# Altium schematic sheet Level Translators.SchDoc
size A2
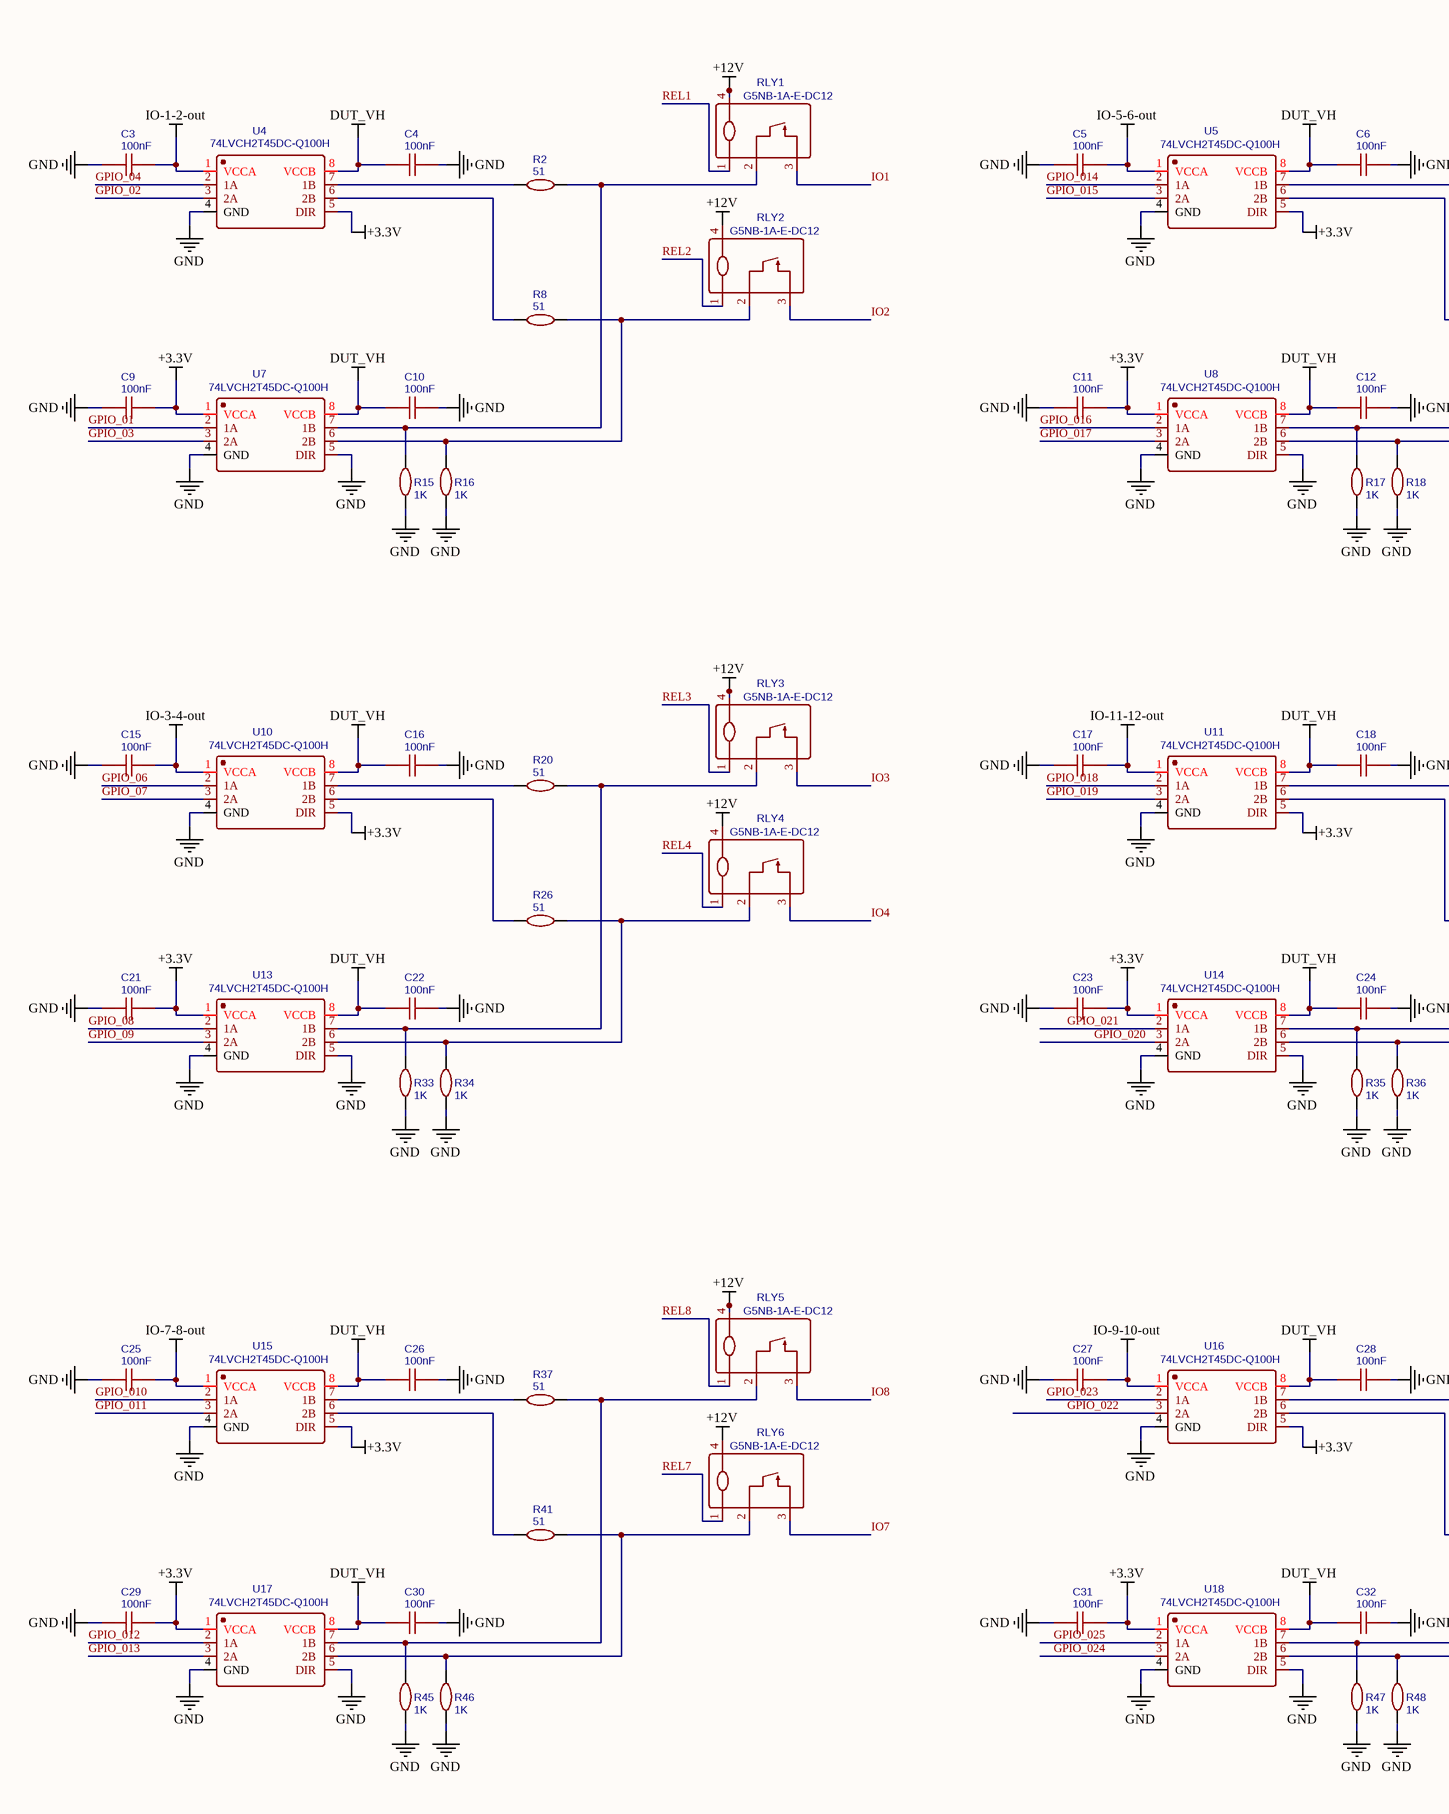
[diagram p0: Level Translators.SchDoc, left]
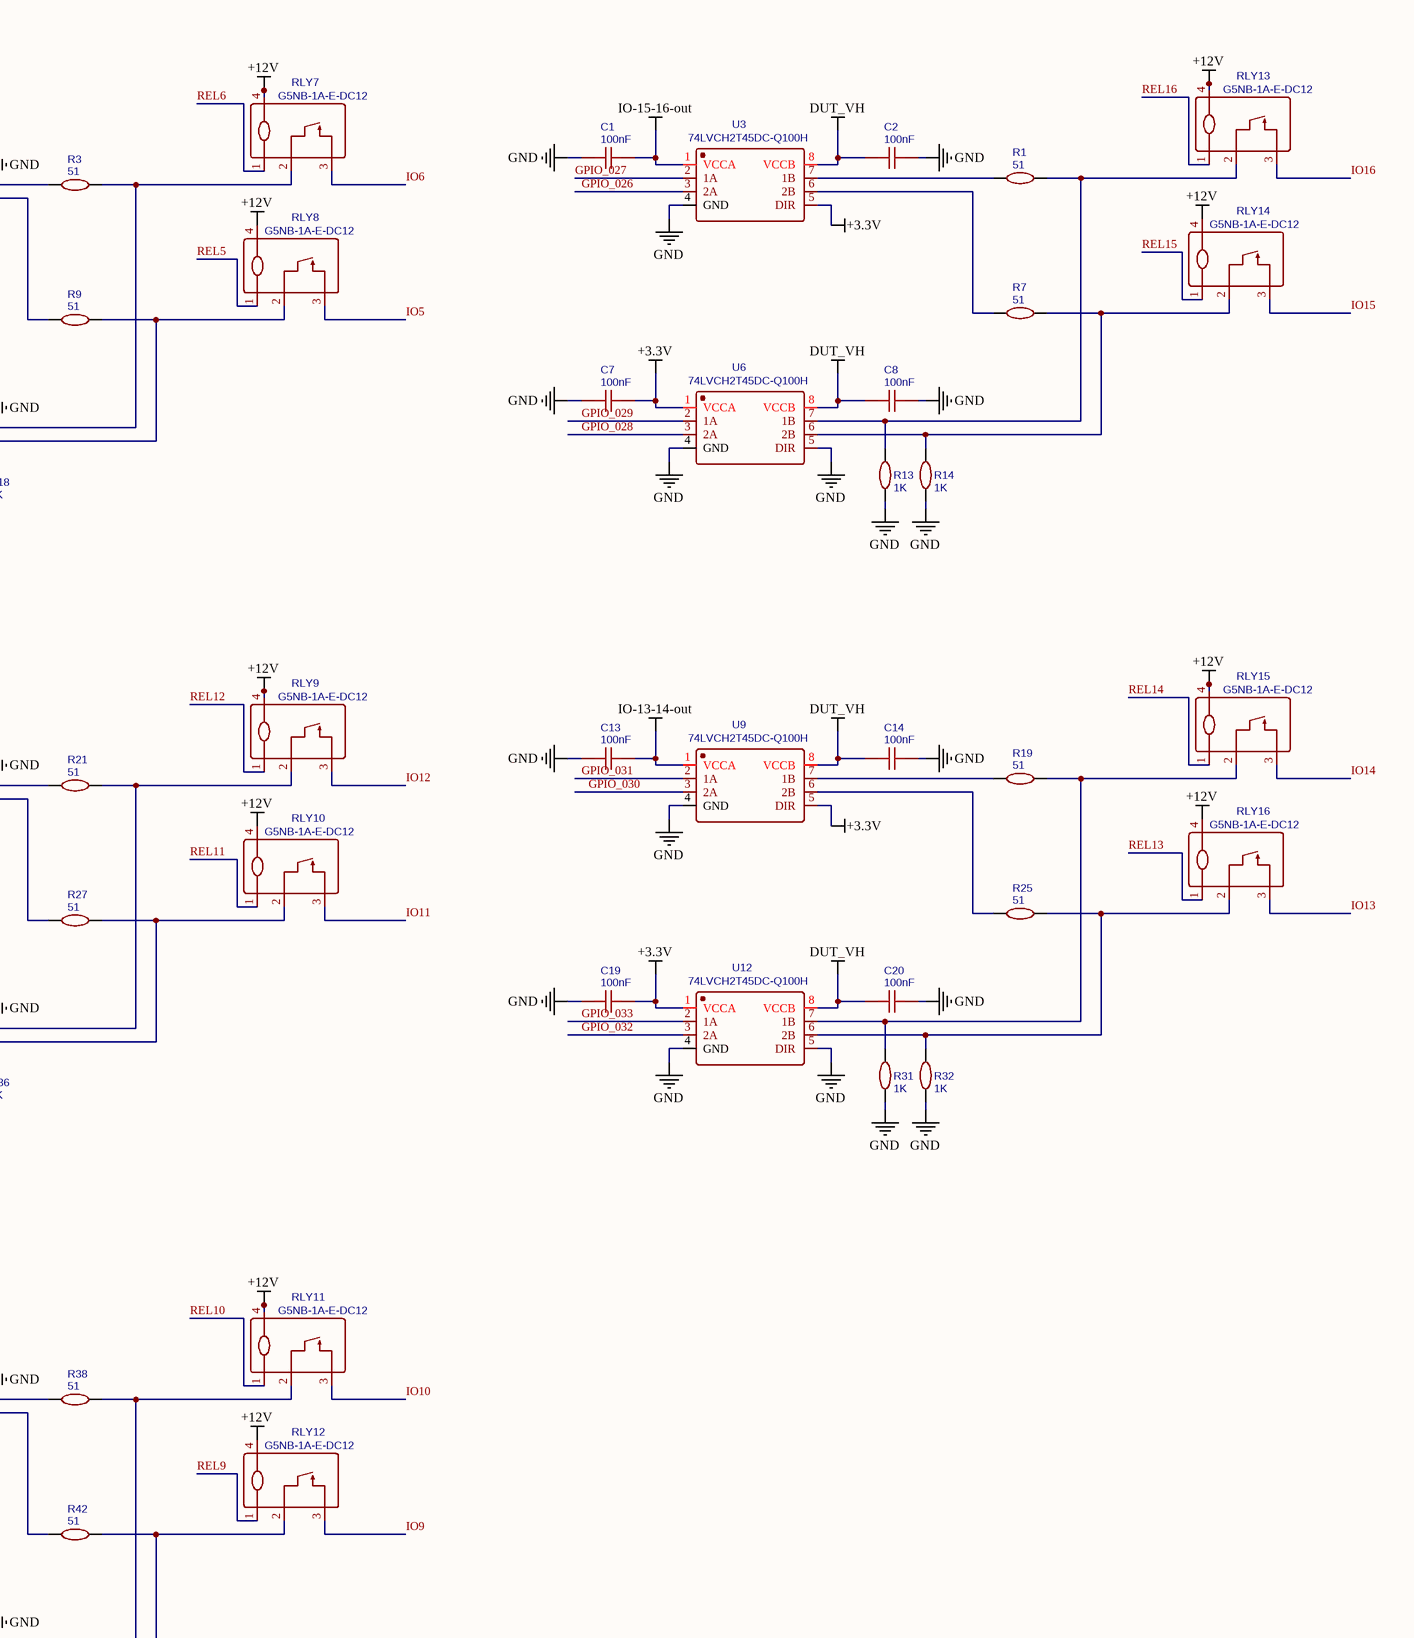
[diagram p1: Level Translators.SchDoc, right]

## Parts
C1  100nF  [C0603]
C2  100nF  [C0603]
C3  100nF  [C0603]
C4  100nF  [C0603]
C5  100nF  [C0603]
C6  100nF  [C0603]
C7  100nF  [C0603]
C8  100nF  [C0603]
C9  100nF  [C0603]
C10  100nF  [C0603]
C11  100nF  [C0603]
C12  100nF  [C0603]
C13  100nF  [C0603]
C14  100nF  [C0603]
C15  100nF  [C0603]
C16  100nF  [C0603]
C17  100nF  [C0603]
C18  100nF  [C0603]
C19  100nF  [C0603]
C20  100nF  [C0603]
C21  100nF  [C0603]
C22  100nF  [C0603]
C23  100nF  [C0603]
C24  100nF  [C0603]
C25  100nF  [C0603]
C26  100nF  [C0603]
C27  100nF  [C0603]
C28  100nF  [C0603]
C29  100nF  [C0603]
C30  100nF  [C0603]
C31  100nF  [C0603]
C32  100nF  [C0603]
R1  51  [R0603]
R2  51  [R0603]
R3  51  [R0603]
R7  51  [R0603]
R8  51  [R0603]
R9  51  [R0603]
R13  1K  [R0603]
R14  1K  [R0603]
R15  1K  [R0603]
R16  1K  [R0603]
R17  1K  [R0603]
R18  1K  [R0603]
R19  51  [R0603]
R20  51  [R0603]
R21  51  [R0603]
R25  51  [R0603]
R26  51  [R0603]
R27  51  [R0603]
R31  1K  [R0603]
R32  1K  [R0603]
R33  1K  [R0603]
R34  1K  [R0603]
R35  1K  [R0603]
R36  1K  [R0603]
R37  51  [R0603]
R38  51  [R0603]
R41  51  [R0603]
R42  51  [R0603]
R45  1K  [R0603]
R46  1K  [R0603]
R47  1K  [R0603]
R48  1K  [R0603]
RLY1  G5NB-1A-E-DC12  [RELAY-TH_G5NB-1A-E-DCXX]
RLY2  G5NB-1A-E-DC12  [RELAY-TH_G5NB-1A-E-DCXX]
RLY3  G5NB-1A-E-DC12  [RELAY-TH_G5NB-1A-E-DCXX]
RLY4  G5NB-1A-E-DC12  [RELAY-TH_G5NB-1A-E-DCXX]
RLY5  G5NB-1A-E-DC12  [RELAY-TH_G5NB-1A-E-DCXX]
RLY6  G5NB-1A-E-DC12  [RELAY-TH_G5NB-1A-E-DCXX]
RLY7  G5NB-1A-E-DC12  [RELAY-TH_G5NB-1A-E-DCXX]
RLY8  G5NB-1A-E-DC12  [RELAY-TH_G5NB-1A-E-DCXX]
RLY9  G5NB-1A-E-DC12  [RELAY-TH_G5NB-1A-E-DCXX]
RLY10  G5NB-1A-E-DC12  [RELAY-TH_G5NB-1A-E-DCXX]
RLY11  G5NB-1A-E-DC12  [RELAY-TH_G5NB-1A-E-DCXX]
RLY12  G5NB-1A-E-DC12  [RELAY-TH_G5NB-1A-E-DCXX]
RLY13  G5NB-1A-E-DC12  [RELAY-TH_G5NB-1A-E-DCXX]
RLY14  G5NB-1A-E-DC12  [RELAY-TH_G5NB-1A-E-DCXX]
RLY15  G5NB-1A-E-DC12  [RELAY-TH_G5NB-1A-E-DCXX]
RLY16  G5NB-1A-E-DC12  [RELAY-TH_G5NB-1A-E-DCXX]
U3  74LVCH2T45DC-Q100H  [VSSOP-8_L2.4-W2.1-P0.50-LS3.2-BR]
U4  74LVCH2T45DC-Q100H  [VSSOP-8_L2.4-W2.1-P0.50-LS3.2-BR]
U5  74LVCH2T45DC-Q100H  [VSSOP-8_L2.4-W2.1-P0.50-LS3.2-BR]
U6  74LVCH2T45DC-Q100H  [VSSOP-8_L2.4-W2.1-P0.50-LS3.2-BR]
U7  74LVCH2T45DC-Q100H  [VSSOP-8_L2.4-W2.1-P0.50-LS3.2-BR]
U8  74LVCH2T45DC-Q100H  [VSSOP-8_L2.4-W2.1-P0.50-LS3.2-BR]
U9  74LVCH2T45DC-Q100H  [VSSOP-8_L2.4-W2.1-P0.50-LS3.2-BR]
U10  74LVCH2T45DC-Q100H  [VSSOP-8_L2.4-W2.1-P0.50-LS3.2-BR]
U11  74LVCH2T45DC-Q100H  [VSSOP-8_L2.4-W2.1-P0.50-LS3.2-BR]
U12  74LVCH2T45DC-Q100H  [VSSOP-8_L2.4-W2.1-P0.50-LS3.2-BR]
U13  74LVCH2T45DC-Q100H  [VSSOP-8_L2.4-W2.1-P0.50-LS3.2-BR]
U14  74LVCH2T45DC-Q100H  [VSSOP-8_L2.4-W2.1-P0.50-LS3.2-BR]
U15  74LVCH2T45DC-Q100H  [VSSOP-8_L2.4-W2.1-P0.50-LS3.2-BR]
U16  74LVCH2T45DC-Q100H  [VSSOP-8_L2.4-W2.1-P0.50-LS3.2-BR]
U17  74LVCH2T45DC-Q100H  [VSSOP-8_L2.4-W2.1-P0.50-LS3.2-BR]
U18  74LVCH2T45DC-Q100H  [VSSOP-8_L2.4-W2.1-P0.50-LS3.2-BR]

## Nets
+3.3V: C7.2 C9.2 C11.2 C19.2 C21.2 C23.2 C29.2 C31.2 U3.5(DIR) U4.5(DIR) U5.5(DIR) U6.1(VCCA) U7.1(VCCA) U8.1(VCCA) U9.5(DIR) U10.5(DIR) U11.5(DIR) U12.1(VCCA) U13.1(VCCA) U14.1(VCCA) U15.5(DIR) U16.5(DIR) U17.1(VCCA) U18.1(VCCA)
+12V: RLY1.4 RLY2.4 RLY3.4 RLY4.4 RLY5.4 RLY6.4 RLY7.4 RLY8.4 RLY9.4 RLY10.4 RLY11.4 RLY12.4 RLY13.4 RLY14.4 RLY15.4 RLY16.4
DUT_VH: C2.1 C4.1 C6.1 C8.1 C10.1 C12.1 C14.1 C16.1 C18.1 C20.1 C22.1 C24.1 C26.1 C28.1 C30.1 C32.1 U3.8(VCCB) U4.8(VCCB) U5.8(VCCB) U6.8(VCCB) U7.8(VCCB) U8.8(VCCB) U9.8(VCCB) U10.8(VCCB) U11.8(VCCB) U12.8(VCCB) U13.8(VCCB) U14.8(VCCB) U15.8(VCCB) U16.8(VCCB) U17.8(VCCB) U18.8(VCCB)
GND: C1.1 C2.2 C3.1 C4.2 C5.1 C6.2 C7.1 C8.2 C9.1 C10.2 C11.1 C12.2 C13.1 C14.2 C15.1 C16.2 C17.1 C18.2 C19.1 C20.2 C21.1 C22.2 C23.1 C24.2 C25.1 C26.2 C27.1 C28.2 C29.1 C30.2 C31.1 C32.2 R13.1 R14.1 R15.1 R16.1 R17.1 R18.1 R31.1 R32.1 R33.1 R34.1 R35.1 R36.1 R45.1 R46.1 R47.1 R48.1 U3.4(GND) U4.4(GND) U5.4(GND) U6.4(GND) U6.5(DIR) U7.4(GND) U7.5(DIR) U8.4(GND) U8.5(DIR) U9.4(GND) U10.4(GND) U11.4(GND) U12.4(GND) U12.5(DIR) U13.4(GND) U13.5(DIR) U14.4(GND) U14.5(DIR) U15.4(GND) U16.4(GND) U17.4(GND) U17.5(DIR) U18.4(GND) U18.5(DIR)
IO-1-2-out: C3.2 U4.1(VCCA)
IO-3-4-out: C15.2 U10.1(VCCA)
IO-5-6-out: C5.2 U5.1(VCCA)
IO-7-8-out: C25.2 U15.1(VCCA)
IO-9-10-out: C27.2 U16.1(VCCA)
IO-11-12-out: C17.2 U11.1(VCCA)
IO-13-14-out: C13.2 U9.1(VCCA)
IO-15-16-out: C1.2 U3.1(VCCA)
GPIO_01: U7.2(1A)
GPIO_02: U4.3(2A)
GPIO_03: U7.3(2A)
GPIO_04: U4.2(1A)
GPIO_06: U10.2(1A)
GPIO_07: U10.3(2A)
GPIO_08: U13.2(1A)
GPIO_09: U13.3(2A)
GPIO_010: U15.2(1A)
GPIO_011: U15.3(2A)
GPIO_012: U17.2(1A)
GPIO_013: U17.3(2A)
GPIO_014: U5.2(1A)
GPIO_015: U5.3(2A)
GPIO_016: U8.2(1A)
GPIO_017: U8.3(2A)
GPIO_018: U11.2(1A)
GPIO_019: U11.3(2A)
GPIO_020: U14.3(2A)
GPIO_021: U14.2(1A)
GPIO_022: U16.3(2A)
GPIO_023: U16.2(1A)
GPIO_024: U18.3(2A)
GPIO_025: U18.2(1A)
GPIO_026: U3.3(2A)
GPIO_027: U3.2(1A)
GPIO_028: U6.3(2A)
GPIO_029: U6.2(1A)
GPIO_030: U9.3(2A)
GPIO_031: U9.2(1A)
GPIO_032: U12.3(2A)
GPIO_033: U12.2(1A)
IO1: RLY1.3
IO2: RLY2.3
IO3: RLY3.3
IO4: RLY4.3
IO5: RLY8.3
IO6: RLY7.3
IO7: RLY6.3
IO8: RLY5.3
IO9: RLY12.3
IO10: RLY11.3
IO11: RLY10.3
IO12: RLY9.3
IO13: RLY16.3
IO14: RLY15.3
IO15: RLY14.3
IO16: RLY13.3
REL1: RLY1.1
REL2: RLY2.1
REL3: RLY3.1
REL4: RLY4.1
REL5: RLY8.1
REL6: RLY7.1
REL7: RLY6.1
REL8: RLY5.1
REL9: RLY12.1
REL10: RLY11.1
REL11: RLY10.1
REL12: RLY9.1
REL13: RLY16.1
REL14: RLY15.1
REL15: RLY14.1
REL16: RLY13.1
NetR1_1: R1.1 U3.7(1B)
NetR1_2: R1.2 R13.2 RLY13.2 U6.7(1B)
NetR2_1: R2.1 U4.7(1B)
NetR2_2: R2.2 R15.2 RLY1.2 U7.7(1B)
NetR3_1: R3.1 U5.7(1B)
NetR3_2: R3.2 R17.2 RLY7.2 U8.7(1B)
NetR7_1: R7.1 U3.6(2B)
NetR7_2: R7.2 R14.2 RLY14.2 U6.6(2B)
NetR8_1: R8.1 U4.6(2B)
NetR8_2: R8.2 R16.2 RLY2.2 U7.6(2B)
NetR9_1: R9.1 U5.6(2B)
NetR9_2: R9.2 R18.2 RLY8.2 U8.6(2B)
NetR19_1: R19.1 U9.7(1B)
NetR19_2: R19.2 R31.2 RLY15.2 U12.7(1B)
NetR20_1: R20.1 U10.7(1B)
NetR20_2: R20.2 R33.2 RLY3.2 U13.7(1B)
NetR21_1: R21.1 U11.7(1B)
NetR21_2: R21.2 R35.2 RLY9.2 U14.7(1B)
NetR25_1: R25.1 U9.6(2B)
NetR25_2: R25.2 R32.2 RLY16.2 U12.6(2B)
NetR26_1: R26.1 U10.6(2B)
NetR26_2: R26.2 R34.2 RLY4.2 U13.6(2B)
NetR27_1: R27.1 U11.6(2B)
NetR27_2: R27.2 R36.2 RLY10.2 U14.6(2B)
NetR37_1: R37.1 U15.7(1B)
NetR37_2: R37.2 R45.2 RLY5.2 U17.7(1B)
NetR38_1: R38.1 U16.7(1B)
NetR38_2: R38.2 R47.2 RLY11.2 U18.7(1B)
NetR41_1: R41.1 U15.6(2B)
NetR41_2: R41.2 R46.2 RLY6.2 U17.6(2B)
NetR42_1: R42.1 U16.6(2B)
NetR42_2: R42.2 R48.2 RLY12.2 U18.6(2B)

## Library data of the parts
C1-C32 = 100nF: Manufacturer: YAGEO; Manufacture Part Number: CC0603KRX7R9BB104; nameAlias: Capacitance; SMT Type: Basic; BOM_LCSC Assembly: Yes; spicePre: C; spiceSymbolName: CC0603KRX7R9BB104; Supplier: LCSC; Supplier Part Number: C14663
R1-R3 R7-R9 R19-R21 R25-R27 R37 R38 R41 R42 = 51: Manufacturer: UniOhm; Manufacture Part Number: 0603WAF510JT5E; nameAlias: Resistance (Ohms); SMT Type: Basic; BOM_LCSC Assembly: Yes; spicePre: R; spiceSymbolName: 0603WAF510JT5E; Supplier: LCSC; Supplier Part Number: C23197
R13-R18 R31-R36 R45-R48 = 1K: Manufacture Part Number: RC0603FR-071KL; Manufacturer: YAGEO; nameAlias: Resistance (Ohms); spicePre: R; spiceSymbolName: RC0603FR-071KL; Supplier: LCSC; Supplier Part Number: C22548
RLY1-RLY16 = G5NB-1A-E-DC12: Manufacturer: Omron Electronics; Contributor: LCSC; spicePre: R; spiceSymbolName: G5NB-1A-E-DC12; Supplier: LCSC; Supplier Part Number: C225714; Manufacture Part Number: G5NB-1A-E-DC12
U3-U18 = 74LVCH2T45DC-Q100H: Manufacturer: Nexperia; Contributor: LCSC; SMT Type: Extend; BOM_LCSC Assembly: Yes; spicePre: U; spiceSymbolName: 74LVCH2T45DC-Q100H; Supplier: LCSC; Manufacture Part Number: 74LVCH2T45DC-Q100H; Supplier Part Number: C116382